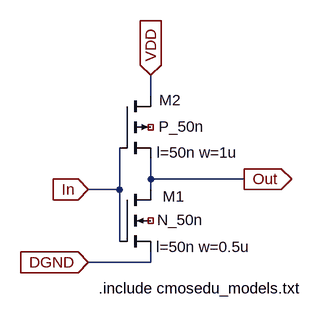
[diagram p0: schematic invert.asc]
invert.asc, the LTspice schematic file:
Version 4
SHEET 1 880 680
WIRE 16 48 16 16
WIRE 16 176 16 144
WIRE 160 176 16 176
WIRE -32 192 -32 128
WIRE -32 192 -80 192
WIRE 16 192 16 176
WIRE -32 272 -32 192
WIRE 16 304 16 288
WIRE 16 304 -80 304
FLAG 16 16 VDD
IOPIN 16 16 In
FLAG -80 192 In
IOPIN -80 192 In
FLAG 160 176 Out
IOPIN 160 176 Out
FLAG -80 304 DGND
IOPIN -80 304 In
SYMBOL nmos4 -32 192 R0
WINDOW 0 66 11 Left 2
WINDOW 3 58 47 Left 2
WINDOW 123 56 88 Left 2
SYMATTR InstName M1
SYMATTR Value N_50n
SYMATTR Value2 l=50n w=0.5u
SYMBOL pmos4 -32 48 R0
WINDOW 0 61 6 Left 2
WINDOW 3 60 47 Left 2
WINDOW 123 57 87 Left 2
SYMATTR InstName M2
SYMATTR Value P_50n
SYMATTR Value2 l=50n w=1u
TEXT -64 344 Left 2 !.include cmosedu_models.txt

The netlist it stands for:
* invert.asc
M1 Out In DGND NC_01 N_50n l=50n w=0.5u
M2 VDD In Out NC_02 P_50n l=50n w=1u
.model NMOS NMOS
.model PMOS PMOS
.lib standard.mos
.include cmosedu_models.txt
.backanno
.end